# EAGLE design relay_board_ssr (EAGLE 6.5.0)
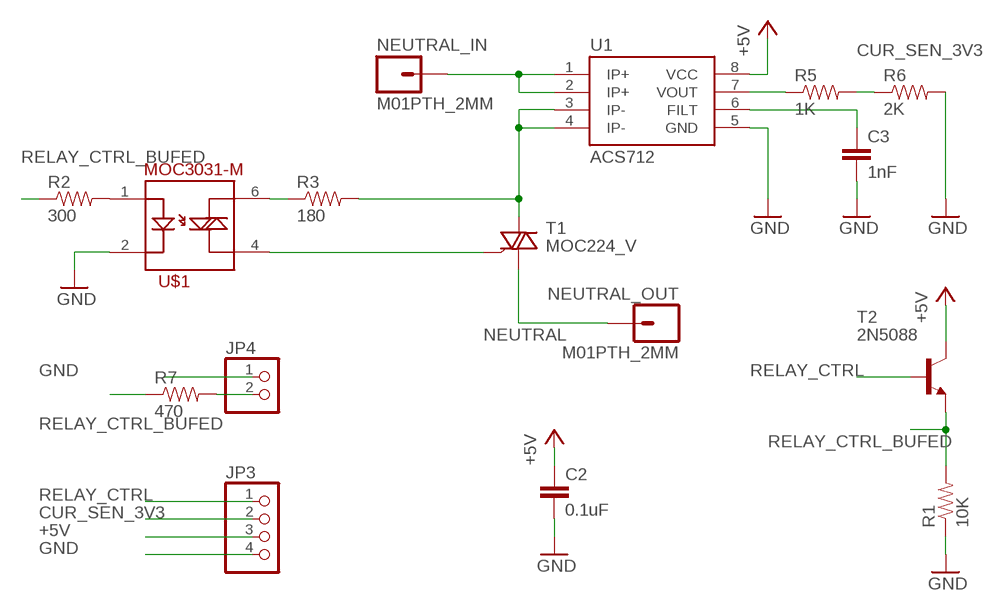
[diagram p0: schematic, sheet 1]

## Parts
C2  0.1uF  CAPEZ  [CAP-PTH-SMALLEZ]
C3  1nF  CAPEZ  [CAP-PTH-SMALLEZ]
JP3  PINHD-1X4  [1X04]
JP4  PINHD-1X2  [1X02]
NEUTRAL_IN  M01PTH_2MM  [1X01_2MM]
NEUTRAL_OUT  M01PTH_2MM  [1X01_2MM]
R1  10K  10KOHM1/6W5%(PTH)VERTICAL  [AXIAL-0.1]
R2  300  10KOHM1/6W5%(PTH)VERTICAL  [AXIAL-0.1]
R3  180  10KOHM1/6W5%(PTH)VERTICAL  [AXIAL-0.1]
R5  1K  10KOHM1/6W5%(PTH)VERTICAL  [AXIAL-0.1]
R6  2K  10KOHM1/6W5%(PTH)VERTICAL  [AXIAL-0.1]
R7  470  10KOHM1/6W5%(PTH)VERTICAL  [AXIAL-0.1]
T1  MOC224_V  BT136MOC224_V  [TO220-IGO]
T2  2N5088  [TO92]
U1  ACS712  [SO08]
U$1  MOC3020  MOC3031-M  [DIL06]

## Nets
+5V: C2.1 JP3.3 T2.1(C) U1.8(VCC)
CUR_SEN_3V3: JP3.2 R5.P$2 R6.P$1
CUR_SEN_5V: R5.P$1 U1.7(VOUT)
GND: C2.2 C3.2 JP3.4 JP4.1 R1.P$1 R6.P$2 U1.5(GND) U$1.2
N$1: R2.P$2 U$1.1
N$2: R3.P$1 U$1.6
N$3: R3.P$2 T1.T2(A2) U1.3(IP-) U1.4(IP-)
N$4: C3.1 U1.6(FILT)
N$5: T1.GATE(G) U$1.4
N$6: NEUTRAL_IN.1 U1.1(IP+) U1.2(IP+)
N$7: JP4.2 R7.P$2
NEUTRAL: NEUTRAL_OUT.1 T1.T1(A1)
RELAY_CTRL: JP3.1 T2.2(B)
RELAY_CTRL_BUFED: R1.P$2 R2.P$1 R7.P$1 T2.3(E)

## Library data of the parts
C2 C3 = SparkFun-Passives:CAP: Capacitor Standard 0603 ceramic capacitor, and 0.1" leaded capacitor.
JP3 = pinhead:PINHD-1X4: PIN HEADER
JP4 = pinhead:PINHD-1X2: PIN HEADER
NEUTRAL_IN NEUTRAL_OUT = SparkFun:M01: Header 1 Standard 1-pin 0.1" header. Use with straight break away headers (SKU : PRT-00116), right angle break away headers (PRT-00553), swiss pins (PRT-00743), machine pins (PRT-00117), and female headers (PRT-00115).
R1-R3 R5-R7 = vertical_resistor:10KOHM1/6W5%(PTH): RES-08375
T1 = mac_224_vertical:BT136: Triac BT136 series E sensitive gate Source: http://www.nxp.com/acrobat_download/datasheets/BT136_SERIES_E_2.pdf
T2 = transistor:2N5088: NPN TRANSISTOR
U1 = SparkFun:ACS712
U$1 = SparkFun-DiscreteSemi:MOC3031-M: Opto-isolated TRIAC

## Net classes
0 default: width 0.508 mm, drill 0.508 mm, clearance 0.508 mm
1 High current: width 5.08 mm, drill 0.254 mm, clearance 1.27 mm

## Board
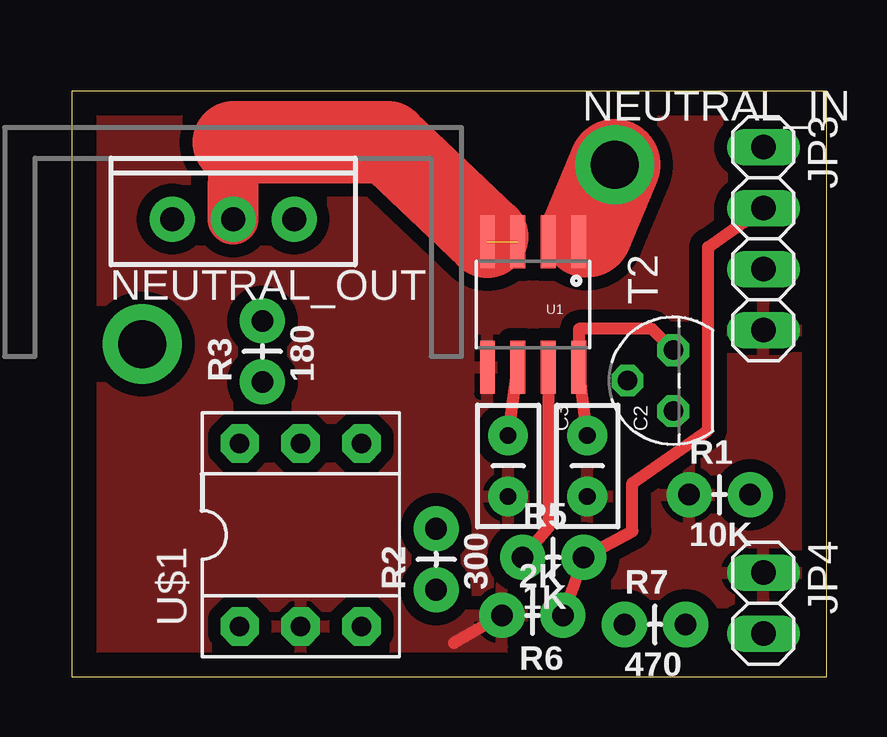
[diagram p1: board, top side]
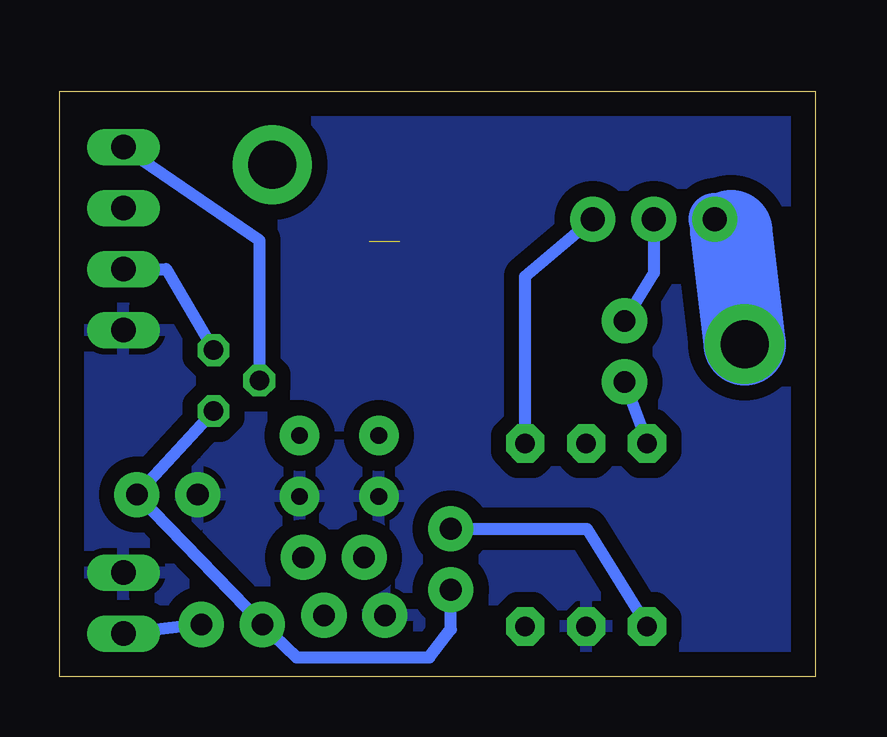
[diagram p2: board, bottom side, seen from below]

Size 31.47 x 24.4 mm. Coordinates in mm from the lower left corner, seen from the top.
Outline: 0,0 31.47,0 31.47,24.4 0,24.4 0,0
Copper layers (1*16): Top 0.035mm / dielectric 1.5mm / Bottom 0.035mm
Design rules "MWSEagleDesignRules2": minimum track width 13mil, minimum drill 22mil, track to track 13mil, track to pad 13mil, pad to pad 13mil, via to via 13mil, smd to smd 8mil, copper to edge 40mil, drill to drill 8mil, minimum pad ring 10mil, minimum via ring 8mil, stop-mask expansion 4mil, vias tented up to drill 0mil, thermal gap 10mil

### Footprints (pad centres in the part's own frame; a part is rotated, then mirrored left to right if it is on the bottom)
CAP-PTH-SMALLEZ = drill 0.7 pad 1.651: 1 0,0; 2 2.54,0
1X04 = drill 1.016 long: 1 -3.81,0; 2 -1.27,0; 3 1.27,0; 4 3.81,0
1X02 = drill 1.016 long: 1 -1.27,0; 2 1.27,0
1X01_2MM = drill 2 pad 3.302: 1 0,0
AXIAL-0.1 = drill 0.9 pad 1.88: P$1 0,0; P$2 2.54,0
TO220-IGO = drill 1 pad 1.88: GATE 2.54,0; T1 -2.54,0; T2 0,0
TO92 = drill 0.813 octagon: 1 1.27,0; 2 0,1.905; 3 -1.27,0
SO08 = smd 0.61 x 2.21: 1 -1.905,-2.616; 2 -0.635,-2.616; 3 0.635,-2.616; 4 1.905,-2.616; 5 1.905,2.616; 6 0.635,2.616; 7 -0.635,2.616; 8 -1.905,2.616
DIL06 = drill 0.813 pad 1.6 octagon: 1 -3.51,-3.81; 2 -0.97,-3.81; 3 1.57,-3.81; 4 1.57,3.81; 5 -0.97,3.81; 6 -3.51,3.81

### Placement (x,y rotation side)
C2  21.49,10.06 270 top
C3  18.19,10.06 270 top
JP3  28.83,18.26 270 top
JP4  28.83,3.07 270 top
NEUTRAL_IN  22.63,21.34 0 top
NEUTRAL_OUT  2.95,13.87 0 top
R1  25.73,7.59 0 top
R2  15.19,3.63 90 top
R3  7.95,12.29 90 top
R5  18.8,4.98 0 top
R6  20.47,2.57 180 top
R7  23.04,2.18 0 top
T1  6.73,19.08 0 top
T2  25.07,12.34 90 top
U1  19.23,15.52 180 top
U$1  10.52,5.92 0 top

### Tracks (layer width: path | path; a pad name or v marks a point on that pad's centre or on a via)
+5V
  Top 0.508: T2.1 24.18,14.5 21.13,14.5 U1.8 C2.1
  Bottom 0.508: JP3.3 27.05,16.99 T2.1
CUR_SEN_3V3
  Top 0.508: R6.P$1 R5.P$2 23.37,6.07 23.37,8.08 26.52,10.29 26.52,17.91 JP3.2
CUR_SEN_5V
  Top 0.508: U1.7 19.86,6.22 R5.P$1
GND
  Top 0.508: R6.P$2 15.93,1.42
  pour Top (isolate 0.533): -0.05,24.56 -0.08,-0.18 31.72,-0.15 31.55,24.41
  pour Bottom (isolate 0.635): -0.05,24.49 -0.05,-0.23 31.55,-0.3 31.55,24.41
N$1
  Bottom 0.508: R2.P$2 9.52,6.17 U$1.1
N$2
  Bottom 0.508: R3.P$1 U$1.6
N$3  (1 unrouted)
  Top 2.032: U1.4 17.32,18.34
  Top 2.134: T1.T2 6.76,22.28
  Top 3.429: 6.76,22.28 13.18,22.28 17.32,18.34
  Bottom 0.508: T1.T2 6.73,16.84 R3.P$2
N$4
  Top 0.508: C3.1 U1.6
N$5
  Bottom 0.508: U$1.4 12.09,16.69 T1.GATE
N$6
  Top 0.508: 19.86,18.06 20.45,18.06 | 19.86,18.06 20.37,18.31 U1.2 | 19.86,18.06 U1.1 20.45,18.06 | 20.45,18.06 21.46,18.54
  Top 3.81: 21.46,18.54 NEUTRAL_IN.1
N$7
  Bottom 0.508: R7.P$2 JP4.2
NEUTRAL
  Bottom 2.159: T1.T1 3.5,18.57
  Bottom 3.429: 3.5,18.57 NEUTRAL_OUT.1
RELAY_CTRL
  Bottom 0.508: T2.2 23.16,18.19 JP3.1
RELAY_CTRL_BUFED
  Bottom 0.508: T2.3 R1.P$2 R7.P$1 21.61,0.81 16.08,0.81 15.19,1.98 R2.P$1